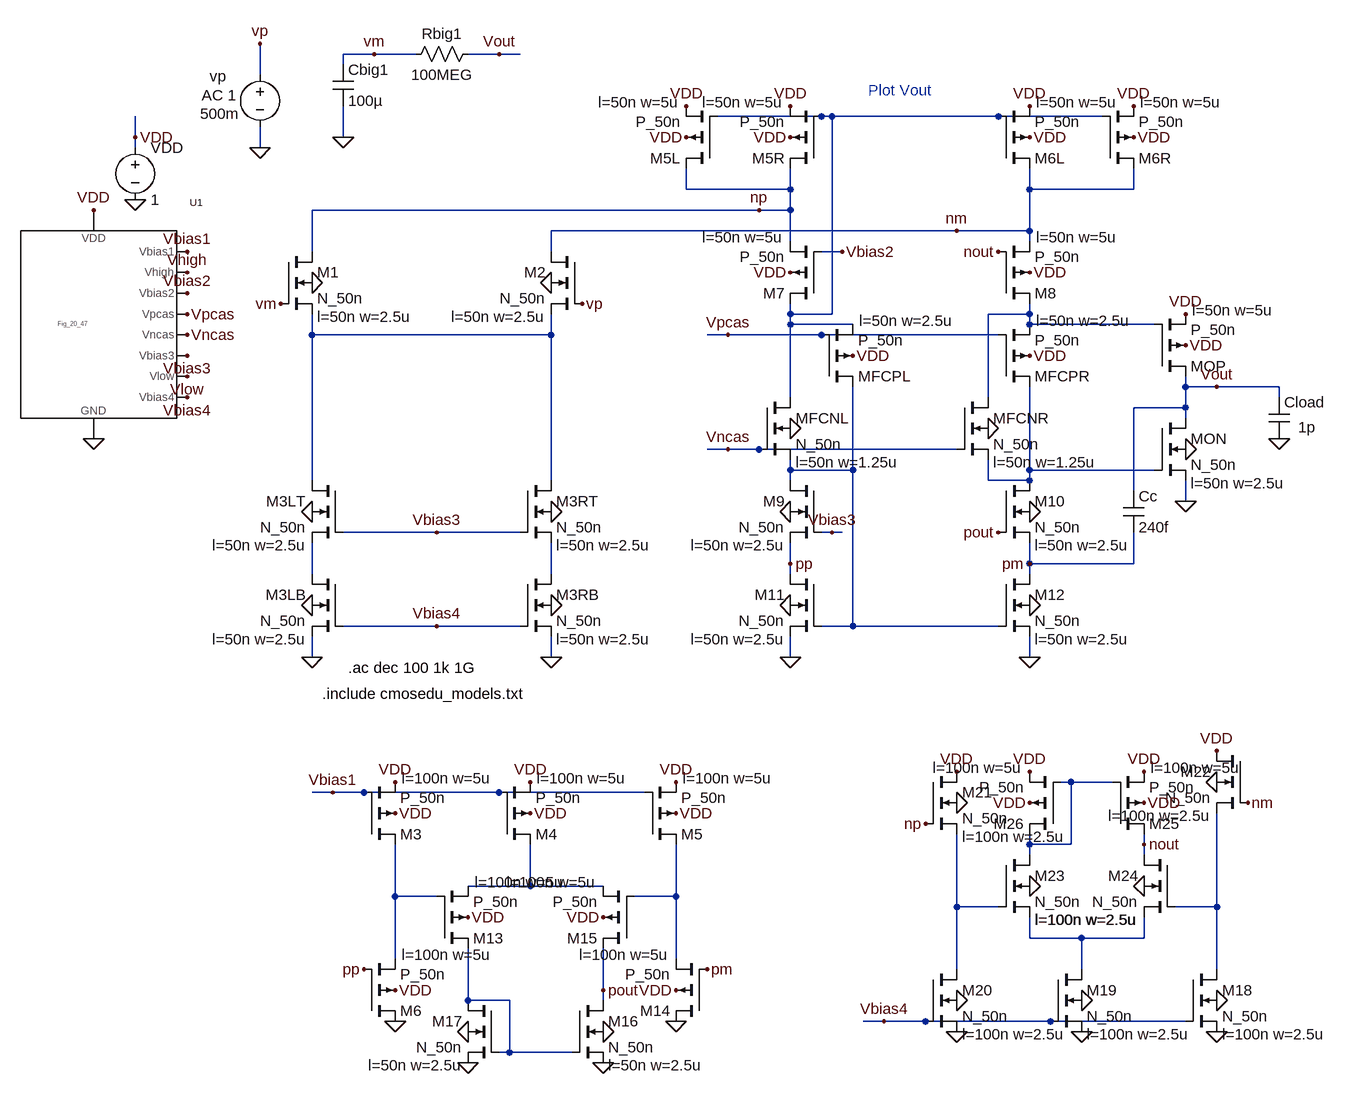
[diagram p0: schematic Fig24_52_AC.asc]
Fig24_52_AC.asc, the LTspice schematic file:
Version 4
SHEET 1 3296 680
WIRE 1728 -1104 1680 -1104
WIRE 1792 -1104 1728 -1104
WIRE 1920 -1104 1872 -1104
WIRE 1952 -1104 1920 -1104
WIRE 1680 -1088 1680 -1104
WIRE 1552 -1072 1552 -1120
WIRE 2416 -1008 2256 -1008
WIRE 2432 -1008 2416 -1008
WIRE 2688 -1008 2432 -1008
WIRE 2848 -1008 2688 -1008
WIRE 1360 -976 1360 -1008
WIRE 1680 -976 1680 -1024
WIRE 1360 -960 1360 -976
WIRE 1552 -960 1552 -992
WIRE 2208 -896 2208 -928
WIRE 2368 -896 2368 -928
WIRE 2368 -896 2208 -896
WIRE 2736 -896 2736 -928
WIRE 2896 -896 2896 -928
WIRE 2896 -896 2736 -896
WIRE 2320 -864 1632 -864
WIRE 2368 -864 2368 -896
WIRE 2368 -864 2320 -864
WIRE 2624 -832 2000 -832
WIRE 2736 -832 2736 -896
WIRE 2736 -832 2624 -832
WIRE 2368 -816 2368 -864
WIRE 2736 -816 2736 -832
WIRE 1632 -800 1632 -864
WIRE 2000 -800 2000 -832
WIRE 2448 -800 2416 -800
WIRE 2368 -704 2368 -720
WIRE 2432 -704 2432 -1008
WIRE 2432 -704 2368 -704
WIRE 2736 -704 2736 -720
WIRE 2736 -704 2672 -704
WIRE 2368 -688 2368 -704
WIRE 2464 -688 2368 -688
WIRE 2736 -688 2736 -704
WIRE 2928 -688 2736 -688
WIRE 1632 -672 1632 -704
WIRE 2000 -672 2000 -704
WIRE 2000 -672 1632 -672
WIRE 2272 -672 2240 -672
WIRE 2416 -672 2272 -672
WIRE 2688 -672 2416 -672
WIRE 2976 -592 2976 -608
WIRE 3024 -592 2976 -592
WIRE 3120 -592 3024 -592
WIRE 2368 -576 2368 -688
WIRE 2672 -576 2672 -704
WIRE 3120 -576 3120 -592
WIRE 2976 -560 2976 -592
WIRE 2976 -560 2896 -560
WIRE 2976 -544 2976 -560
WIRE 2272 -496 2240 -496
WIRE 2320 -496 2272 -496
WIRE 2624 -496 2320 -496
WIRE 2368 -464 2368 -480
WIRE 2464 -464 2464 -592
WIRE 2464 -464 2368 -464
WIRE 2736 -464 2736 -592
WIRE 2928 -464 2736 -464
WIRE 1632 -448 1632 -672
WIRE 2000 -448 2000 -672
WIRE 2368 -448 2368 -464
WIRE 2672 -448 2672 -480
WIRE 2736 -448 2736 -464
WIRE 2736 -448 2672 -448
WIRE 2896 -432 2896 -560
WIRE 2976 -416 2976 -448
WIRE 1824 -368 1680 -368
WIRE 1952 -368 1824 -368
WIRE 2432 -368 2416 -368
WIRE 2448 -368 2432 -368
WIRE 2368 -320 2368 -352
WIRE 2736 -320 2736 -352
WIRE 2896 -320 2896 -368
WIRE 2896 -320 2736 -320
WIRE 1632 -304 1632 -352
WIRE 2000 -304 2000 -352
WIRE 2368 -304 2368 -320
WIRE 2736 -304 2736 -320
WIRE 1824 -224 1680 -224
WIRE 1952 -224 1824 -224
WIRE 2464 -224 2464 -464
WIRE 2464 -224 2416 -224
WIRE 2688 -224 2464 -224
WIRE 1632 -176 1632 -208
WIRE 2000 -176 2000 -208
WIRE 2368 -176 2368 -208
WIRE 2736 -176 2736 -208
WIRE 2800 16 2784 16
WIRE 2864 16 2800 16
WIRE 1664 32 1632 32
WIRE 1712 32 1664 32
WIRE 1920 32 1712 32
WIRE 2144 32 1920 32
WIRE 2736 112 2736 96
WIRE 2800 112 2800 16
WIRE 2800 112 2736 112
WIRE 2912 112 2912 96
WIRE 2736 128 2736 112
WIRE 2912 128 2912 112
WIRE 1968 176 1968 112
WIRE 1968 176 1872 176
WIRE 2080 176 1968 176
WIRE 1760 192 1760 112
WIRE 1824 192 1760 192
WIRE 2192 192 2192 112
WIRE 2192 192 2128 192
WIRE 2624 208 2624 96
WIRE 2688 208 2624 208
WIRE 3024 208 3024 64
WIRE 3024 208 2960 208
WIRE 2736 256 2736 224
WIRE 2816 256 2736 256
WIRE 2912 256 2912 224
WIRE 2912 256 2816 256
WIRE 1760 288 1760 192
WIRE 2192 288 2192 192
WIRE 2624 304 2624 208
WIRE 2816 304 2816 256
WIRE 3024 304 3024 208
WIRE 2080 336 2080 272
WIRE 1872 352 1872 272
WIRE 1936 352 1872 352
WIRE 2080 352 2080 336
WIRE 2512 384 2480 384
WIRE 2576 384 2512 384
WIRE 2768 384 2576 384
WIRE 2976 384 2768 384
WIRE 1936 432 1936 352
WIRE 1936 432 1920 432
WIRE 2032 432 1936 432
FLAG 1360 -880 0
FLAG 1360 -976 VDD
FLAG 1296 -864 VDD
FLAG 1296 -512 0
FLAG 1440 -800 Vbias1
FLAG 1440 -768 Vhigh
FLAG 1440 -736 Vbias2
FLAG 1440 -640 Vbias3
FLAG 1440 -704 Vpcas
FLAG 1440 -672 Vncas
FLAG 1440 -576 Vbias4
FLAG 1440 -608 Vlow
FLAG 2896 -976 VDD
FLAG 1632 -752 0
FLAG 2000 -752 0
FLAG 1584 -720 vm
FLAG 2048 -720 vp
FLAG 2000 -400 0
FLAG 2000 -256 0
FLAG 2000 -176 0
FLAG 1632 -400 0
FLAG 1632 -256 0
FLAG 1632 -176 0
FLAG 1824 -368 Vbias3
FLAG 1824 -224 Vbias4
FLAG 2736 -400 0
FLAG 2736 -256 0
FLAG 2736 -176 0
FLAG 2368 -400 0
FLAG 2368 -256 0
FLAG 2368 -176 0
FLAG 2432 -368 Vbias3
FLAG 2736 -976 VDD
FLAG 2736 -1024 VDD
FLAG 2896 -1024 VDD
FLAG 2208 -976 VDD
FLAG 2368 -976 VDD
FLAG 2368 -1024 VDD
FLAG 2208 -1024 VDD
FLAG 2736 -768 VDD
FLAG 2368 -768 VDD
FLAG 2448 -800 Vbias2
FLAG 3120 -512 0
FLAG 1552 -960 0
FLAG 1552 -1120 vp
FLAG 3024 -592 Vout
FLAG 2464 -640 VDD
FLAG 2736 -640 VDD
FLAG 2672 -528 0
FLAG 2368 -528 0
FLAG 2272 -672 Vpcas
FLAG 2272 -496 Vncas
FLAG 2976 -656 VDD
FLAG 2976 -704 VDD
FLAG 2976 -496 0
FLAG 2976 -416 0
FLAG 1680 -976 0
FLAG 1920 -1104 Vout
FLAG 1728 -1104 vm
FLAG 2688 -800 nout
FLAG 2624 -832 nm
FLAG 2320 -864 np
FLAG 2688 -368 pout
FLAG 2736 -320 pm
FLAG 2368 -320 pp
FLAG 1760 64 VDD
FLAG 1760 16 VDD
FLAG 1968 64 VDD
FLAG 1968 16 VDD
FLAG 2192 64 VDD
FLAG 2192 16 VDD
FLAG 1664 32 Vbias1
FLAG 1760 336 VDD
FLAG 1872 224 VDD
FLAG 2192 336 VDD
FLAG 2080 224 VDD
FLAG 2080 400 0
FLAG 1872 400 0
FLAG 1872 448 0
FLAG 2080 448 0
FLAG 2192 384 0
FLAG 1760 384 0
FLAG 1712 304 pp
FLAG 2240 304 pm
FLAG 2080 336 pout
FLAG 3024 352 0
FLAG 3024 400 0
FLAG 2816 352 0
FLAG 2816 400 0
FLAG 2624 352 0
FLAG 2624 400 0
FLAG 2512 384 Vbias4
FLAG 2624 48 0
FLAG 3024 16 0
FLAG 2624 0 VDD
FLAG 3024 -32 VDD
FLAG 2576 80 np
FLAG 3072 48 nm
FLAG 2736 176 0
FLAG 2912 176 0
FLAG 2912 48 VDD
FLAG 2912 0 VDD
FLAG 2736 48 VDD
FLAG 2736 0 VDD
FLAG 2912 112 nout
SYMBOL voltage 1360 -976 R0
WINDOW 123 0 0 Left 2
WINDOW 39 0 0 Left 2
SYMATTR InstName VDD
SYMATTR Value 1
SYMBOL Fig_20_47 1296 -688 R0
SYMATTR InstName U1
SYMBOL pmos4 2848 -928 M180
WINDOW 123 58 102 Left 2
WINDOW 0 56 16 Left 2
SYMATTR Value2 l=50n w=5u
SYMATTR InstName M6R
SYMATTR Value P_50n
SYMBOL nmos4 1584 -800 R0
WINDOW 123 56 100 Left 2
SYMATTR Value2 l=50n w=2.5u
SYMATTR InstName M1
SYMATTR Value N_50n
SYMBOL nmos4 2048 -800 M0
WINDOW 123 56 100 Left 2
SYMATTR Value2 l=50n w=2.5u
SYMATTR InstName M2
SYMATTR Value N_50n
SYMBOL nmos4 1952 -448 R0
WINDOW 123 56 100 Left 2
SYMATTR Value2 l=50n w=2.5u
SYMATTR InstName M3RT
SYMATTR Value N_50n
SYMBOL nmos4 1952 -304 R0
WINDOW 123 56 100 Left 2
SYMATTR Value2 l=50n w=2.5u
SYMATTR InstName M3RB
SYMATTR Value N_50n
SYMBOL nmos4 1680 -448 M0
WINDOW 123 56 100 Left 2
SYMATTR Value2 l=50n w=2.5u
SYMATTR InstName M3LT
SYMATTR Value N_50n
SYMBOL nmos4 1680 -304 M0
WINDOW 123 56 100 Left 2
SYMATTR Value2 l=50n w=2.5u
SYMATTR InstName M3LB
SYMATTR Value N_50n
SYMBOL nmos4 2688 -448 R0
WINDOW 123 56 100 Left 2
SYMATTR Value2 l=50n w=2.5u
SYMATTR InstName M10
SYMATTR Value N_50n
SYMBOL nmos4 2688 -304 R0
WINDOW 123 56 100 Left 2
SYMATTR Value2 l=50n w=2.5u
SYMATTR InstName M12
SYMATTR Value N_50n
SYMBOL nmos4 2416 -448 M0
WINDOW 123 56 100 Left 2
SYMATTR Value2 l=50n w=2.5u
SYMATTR InstName M9
SYMATTR Value N_50n
SYMBOL nmos4 2416 -304 M0
WINDOW 123 56 100 Left 2
SYMATTR Value2 l=50n w=2.5u
SYMATTR InstName M11
SYMATTR Value N_50n
SYMBOL pmos4 2688 -928 M180
WINDOW 123 58 102 Left 2
WINDOW 0 56 16 Left 2
SYMATTR Value2 l=50n w=5u
SYMATTR InstName M6L
SYMATTR Value P_50n
SYMBOL pmos4 2256 -928 R180
WINDOW 123 58 102 Left 2
WINDOW 0 56 16 Left 2
SYMATTR Value2 l=50n w=5u
SYMATTR InstName M5L
SYMATTR Value P_50n
SYMBOL pmos4 2416 -928 R180
WINDOW 123 58 102 Left 2
WINDOW 0 56 16 Left 2
SYMATTR Value2 l=50n w=5u
SYMATTR InstName M5R
SYMATTR Value P_50n
SYMBOL pmos4 2688 -720 M180
WINDOW 123 58 102 Left 2
WINDOW 0 56 16 Left 2
SYMATTR Value2 l=50n w=5u
SYMATTR InstName M8
SYMATTR Value P_50n
SYMBOL pmos4 2416 -720 R180
WINDOW 123 58 102 Left 2
WINDOW 0 56 16 Left 2
SYMATTR Value2 l=50n w=5u
SYMATTR InstName M7
SYMATTR Value P_50n
SYMBOL cap 3104 -576 R0
WINDOW 3 45 46 Left 2
SYMATTR Value 1p
SYMATTR InstName Cload
SYMBOL voltage 1552 -1088 R0
WINDOW 0 -77 18 Left 2
WINDOW 3 -92 76 Left 2
WINDOW 123 -90 47 Left 2
WINDOW 39 0 0 Left 2
SYMATTR InstName vp
SYMATTR Value 500m
SYMATTR Value2 AC 1
SYMBOL pmos4 2416 -592 M180
WINDOW 123 58 102 Left 2
WINDOW 0 56 16 Left 2
SYMATTR Value2 l=50n w=2.5u
SYMATTR InstName MFCPL
SYMATTR Value P_50n
SYMBOL pmos4 2688 -592 M180
WINDOW 123 58 102 Left 2
WINDOW 0 56 16 Left 2
SYMATTR Value2 l=50n w=2.5u
SYMATTR InstName MFCPR
SYMATTR Value P_50n
SYMBOL nmos4 2624 -576 R0
WINDOW 123 56 100 Left 2
SYMATTR Value2 l=50n w=1.25u
SYMATTR InstName MFCNR
SYMATTR Value N_50n
SYMBOL nmos4 2320 -576 R0
WINDOW 123 56 100 Left 2
SYMATTR Value2 l=50n w=1.25u
SYMATTR InstName MFCNL
SYMATTR Value N_50n
SYMBOL pmos4 2928 -608 M180
WINDOW 123 58 102 Left 2
WINDOW 0 56 16 Left 2
SYMATTR Value2 l=50n w=5u
SYMATTR InstName MOP
SYMATTR Value P_50n
SYMBOL nmos4 2928 -544 R0
WINDOW 123 56 100 Left 2
SYMATTR Value2 l=50n w=2.5u
SYMATTR InstName MON
SYMATTR Value N_50n
SYMBOL cap 2880 -432 R0
SYMATTR InstName Cc
SYMATTR Value 240f
SYMBOL cap 1664 -1088 R0
SYMATTR InstName Cbig1
SYMATTR Value 100µ
SYMBOL res 1776 -1088 R270
WINDOW 0 32 56 VTop 2
WINDOW 3 0 56 VBottom 2
SYMATTR InstName Rbig1
SYMATTR Value 100MEG
SYMBOL pmos4 1712 112 M180
WINDOW 123 58 102 Left 2
WINDOW 0 56 16 Left 2
SYMATTR Value2 l=100n w=5u
SYMATTR InstName M3
SYMATTR Value P_50n
SYMBOL pmos4 1920 112 M180
WINDOW 123 58 102 Left 2
WINDOW 0 56 16 Left 2
SYMATTR Value2 l=100n w=5u
SYMATTR InstName M4
SYMATTR Value P_50n
SYMBOL pmos4 2144 112 M180
WINDOW 123 58 102 Left 2
WINDOW 0 56 16 Left 2
SYMATTR Value2 l=100n w=5u
SYMATTR InstName M5
SYMATTR Value P_50n
SYMBOL pmos4 1712 384 M180
WINDOW 123 58 102 Left 2
WINDOW 0 56 16 Left 2
SYMATTR Value2 l=100n w=5u
SYMATTR InstName M6
SYMATTR Value P_50n
SYMBOL pmos4 1824 272 M180
WINDOW 123 58 102 Left 2
WINDOW 0 56 16 Left 2
SYMATTR Value2 l=100n w=5u
SYMATTR InstName M13
SYMATTR Value P_50n
SYMBOL pmos4 2240 384 R180
WINDOW 123 58 102 Left 2
WINDOW 0 56 16 Left 2
SYMATTR Value2 l=100n w=5u
SYMATTR InstName M14
SYMATTR Value P_50n
SYMBOL pmos4 2128 272 R180
WINDOW 123 58 102 Left 2
WINDOW 0 56 16 Left 2
SYMATTR Value2 l=100n w=5u
SYMATTR InstName M15
SYMATTR Value P_50n
SYMBOL nmos4 2032 352 R0
WINDOW 123 56 100 Left 2
SYMATTR Value2 l=50n w=2.5u
SYMATTR InstName M16
SYMATTR Value N_50n
SYMBOL nmos4 1920 352 M0
WINDOW 123 56 100 Left 2
SYMATTR Value2 l=50n w=2.5u
SYMATTR InstName M17
SYMATTR Value N_50n
SYMBOL nmos4 2976 304 R0
WINDOW 123 56 100 Left 2
SYMATTR Value2 l=100n w=2.5u
SYMATTR InstName M18
SYMATTR Value N_50n
SYMBOL nmos4 2768 304 R0
WINDOW 123 56 100 Left 2
SYMATTR Value2 l=100n w=2.5u
SYMATTR InstName M19
SYMATTR Value N_50n
SYMBOL nmos4 2576 304 R0
WINDOW 123 56 100 Left 2
SYMATTR Value2 l=100n w=2.5u
SYMATTR InstName M20
SYMATTR Value N_50n
SYMBOL nmos4 2576 0 R0
WINDOW 123 56 100 Left 2
SYMATTR Value2 l=100n w=2.5u
SYMATTR InstName M21
SYMATTR Value N_50n
SYMBOL nmos4 3072 -32 M0
WINDOW 123 56 100 Left 2
SYMATTR Value2 l=100n w=2.5u
SYMATTR InstName M22
SYMATTR Value N_50n
SYMBOL nmos4 2688 128 R0
WINDOW 123 56 100 Left 2
SYMATTR Value2 l=100n w=2.5u
SYMATTR InstName M23
SYMATTR Value N_50n
SYMBOL nmos4 2960 128 M0
WINDOW 123 56 100 Left 2
SYMATTR Value2 l=100n w=2.5u
SYMATTR InstName M24
SYMATTR Value N_50n
SYMBOL pmos4 2864 96 M180
WINDOW 123 58 102 Left 2
WINDOW 0 56 16 Left 2
SYMATTR Value2 l=100n w=5u
SYMATTR InstName M25
SYMATTR Value P_50n
SYMBOL pmos4 2784 96 R180
WINDOW 123 58 102 Left 2
WINDOW 0 56 16 Left 2
SYMATTR Value2 l=100n w=5u
SYMATTR InstName M26
SYMATTR Value P_50n
TEXT 1648 -120 Left 2 !.include cmosedu_models.txt
TEXT 2488 -1048 Left 2 ;Plot Vout
TEXT 1688 -160 Left 2 !.ac dec 100 1k 1G

The netlist it stands for:
* Fig24_52_AC.asc
VDD VDD 0 1
XU1 Vbias1 Vhigh Vbias2 Vpcas Vncas Vbias3 Vlow Vbias4 VDD 0 Fig_20_47  ; pins Vbias1 Vhigh Vbias2 Vpcas Vncas Vbias3 Vlow Vbias4 VDD GND
M6R nm N001 VDD VDD P_50n l=50n w=5u
M1 np vm N003 0 N_50n l=50n w=2.5u
M2 nm vp N003 0 N_50n l=50n w=2.5u
M3RT N003 Vbias3 N007 0 N_50n l=50n w=2.5u
M3RB N007 Vbias4 0 0 N_50n l=50n w=2.5u
M3LT N003 Vbias3 N006 0 N_50n l=50n w=2.5u
M3LB N006 Vbias4 0 0 N_50n l=50n w=2.5u
M10 N005 pout pm 0 N_50n l=50n w=2.5u
M12 pm N004 0 0 N_50n l=50n w=2.5u
M9 N004 Vbias3 pp 0 N_50n l=50n w=2.5u
M11 pp N004 0 0 N_50n l=50n w=2.5u
M6L nm N001 VDD VDD P_50n l=50n w=5u
M5L np N001 VDD VDD P_50n l=50n w=5u
M5R np N001 VDD VDD P_50n l=50n w=5u
M8 N002 nout nm VDD P_50n l=50n w=5u
M7 N001 Vbias2 np VDD P_50n l=50n w=5u
Cload Vout 0 1p
vp vp 0 500m AC 1
MFCPL N004 Vpcas N001 VDD P_50n l=50n w=2.5u
MFCPR N005 Vpcas N002 VDD P_50n l=50n w=2.5u
MFCNR N002 Vncas N005 0 N_50n l=50n w=1.25u
MFCNL N001 Vncas N004 0 N_50n l=50n w=1.25u
MOP Vout N002 VDD VDD P_50n l=50n w=5u
MON Vout N005 0 0 N_50n l=50n w=2.5u
Cc Vout pm 240f
Cbig1 vm 0 100µ
Rbig1 vm Vout 100MEG
M3 N010 Vbias1 VDD VDD P_50n l=100n w=5u
M4 N009 Vbias1 VDD VDD P_50n l=100n w=5u
M5 N011 Vbias1 VDD VDD P_50n l=100n w=5u
M6 0 pp N010 VDD P_50n l=100n w=5u
M13 N015 N010 N009 VDD P_50n l=100n w=5u
M14 0 pm N011 VDD P_50n l=100n w=5u
M15 pout N011 N009 VDD P_50n l=100n w=5u
M16 pout N015 0 0 N_50n l=50n w=2.5u
M17 N015 N015 0 0 N_50n l=50n w=2.5u
M18 N013 Vbias4 0 0 N_50n l=100n w=2.5u
M19 N014 Vbias4 0 0 N_50n l=100n w=2.5u
M20 N012 Vbias4 0 0 N_50n l=100n w=2.5u
M21 VDD np N012 0 N_50n l=100n w=2.5u
M22 VDD nm N013 0 N_50n l=100n w=2.5u
M23 N008 N012 N014 0 N_50n l=100n w=2.5u
M24 nout N013 N014 0 N_50n l=100n w=2.5u
M25 nout N008 VDD VDD P_50n l=100n w=5u
M26 N008 N008 VDD VDD P_50n l=100n w=5u
.model NMOS NMOS
.model PMOS PMOS
.lib standard.mos
.include cmosedu_models.txt
* Plot Vout
.ac dec 100 1k 1G
.backanno
.end